# EasyEDA Pro project ProPrj_Syndra Version 2_2026-02-07.epro, schematic Schematic1
Board Name: Control Board; Create Date: 2025-08-30; Page Name: Systems; Project Name: Syndra Version 2; Schematic Name: Schematic1; Update Date: 2026-01-21; Company: EasyEDA.com; Page Size: A4; Version: V1.0
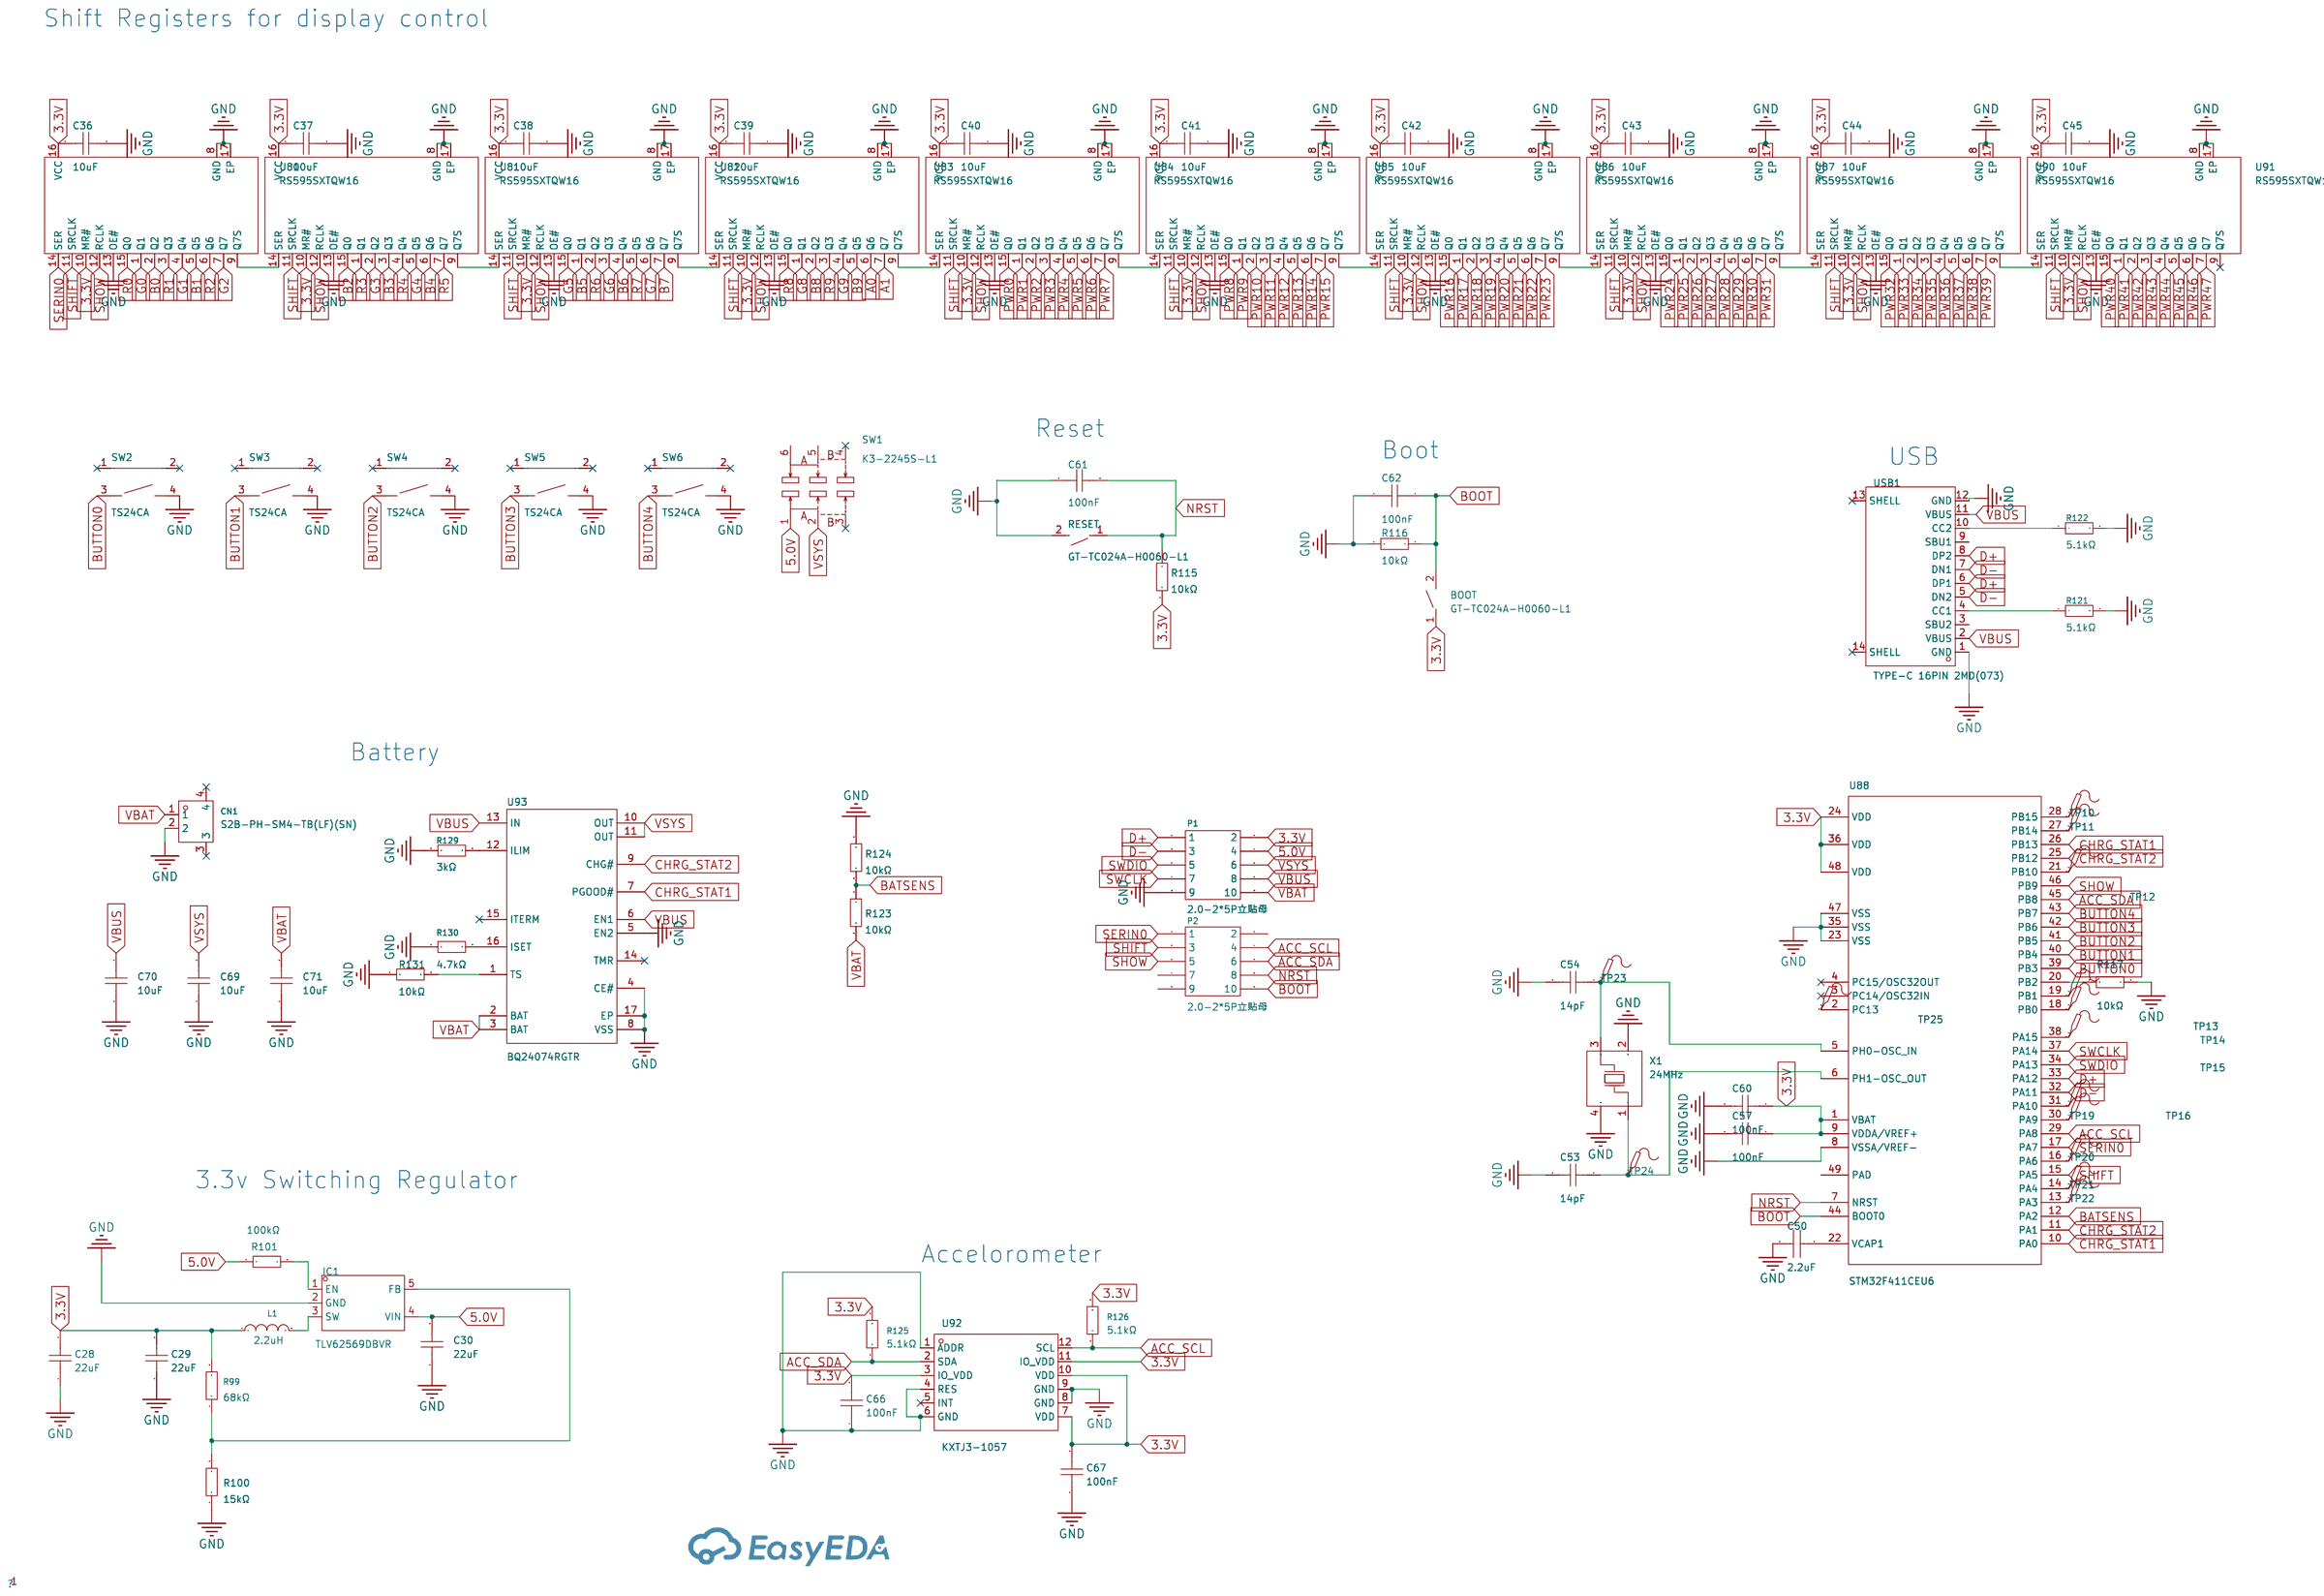
[diagram p1: schematic sheet]

## Parts
BOOT  GT-TC024A-H0060-L1  [SW-SMD_L3.0-W2.0-LS3.5]
C28  22uF  [C0603]
C29  22uF  [C0603]
C30  22uF  [C0603]
C36  10uF  [C0402]
C37  10uF  [C0402]
C38  10uF  [C0402]
C39  10uF  [C0402]
C40  10uF  [C0402]
C41  10uF  [C0402]
C42  10uF  [C0402]
C43  10uF  [C0402]
C44  10uF  [C0402]
C45  10uF  [C0402]
C50  2.2uF  [C0402]
C53  14pF  [C0402]
C54  14pF  [C0402]
C57  100nF  [C0402]
C60  100nF  [C0402]
C61  100nF  [C0402]
C62  100nF  [C0402]
C66  100nF  [C0402]
C67  100nF  [C0402]
C69  10uF  [C0402]
C70  10uF  [C0402]
C71  10uF  [C0402]
CN1  S2B-PH-SM4-TB(LF)(SN)  [CONN-SMD_P2.00_S2B-PH-SM4-TB-LF-SN]
IC1  TLV62569DBVR  [SOT-23-5_L3.0-W1.7-P0.95-LS2.8-BR]
L1  2.2uH  [IND-SMD_L2.5-W2.0]
P1  2.0-2*5P立贴母  [HDR-SMD_10P-P2.00-V-F-R2-C5-S2.00-LS6.0]
P2  2.0-2*5P立贴母  [HDR-SMD_10P-P2.00-V-F-R2-C5-S2.00-LS6.0]
R99  68kΩ  [R0402]
R100  15kΩ  [R0402]
R101  100kΩ  [R0402]
R115  10kΩ  [R0402]
R116  10kΩ  [R0402]
R117  10kΩ  [R0402]
R121  5.1kΩ  [R0402]
R122  5.1kΩ  [R0402]
R123  10kΩ  [R0402]
R124  10kΩ  [R0402]
R125  5.1kΩ  [R0402]
R126  5.1kΩ  [R0402]
R129  3kΩ  [R0603]
R130  4.7kΩ  [R0402]
R131  10kΩ  [R0402]
RESET  GT-TC024A-H0060-L1  [SW-SMD_L3.0-W2.0-LS3.5]
SW1  K3-2245S-L1  [SW-TH_K3-2245S-L1]
SW2  TS24CA  [SW-SMD_TS24CA]
SW3  TS24CA  [SW-SMD_TS24CA]
SW4  TS24CA  [SW-SMD_TS24CA]
SW5  TS24CA  [SW-SMD_TS24CA]
SW6  TS24CA  [SW-SMD_TS24CA]
TP10  -  [Test-Point-0.5mm]
TP11  -  [Test-Point-0.5mm]
TP12  -  [Test-Point-0.5mm]
TP13  -  [Test-Point-0.5mm]
TP14  -  [Test-Point-0.5mm]
TP15  -  [Test-Point-0.5mm]
TP16  -  [Test-Point-0.5mm]
TP19  -  [Test-Point-0.5mm]
TP20  -  [Test-Point-0.5mm]
TP21  -  [Test-Point-0.5mm]
TP22  -  [Test-Point-0.5mm]
TP23  -  [Test-Point-0.5mm]
TP24  -  [Test-Point-0.5mm]
TP25  -  [Test-Point-0.5mm]
U80  RS595SXTQW16  [DHVQFN-16_L3.5-W2.5-P0.50-BL-EP]
U81  RS595SXTQW16  [DHVQFN-16_L3.5-W2.5-P0.50-BL-EP]
U82  RS595SXTQW16  [DHVQFN-16_L3.5-W2.5-P0.50-BL-EP]
U83  RS595SXTQW16  [DHVQFN-16_L3.5-W2.5-P0.50-BL-EP]
U84  RS595SXTQW16  [DHVQFN-16_L3.5-W2.5-P0.50-BL-EP]
U85  RS595SXTQW16  [DHVQFN-16_L3.5-W2.5-P0.50-BL-EP]
U86  RS595SXTQW16  [DHVQFN-16_L3.5-W2.5-P0.50-BL-EP]
U87  RS595SXTQW16  [DHVQFN-16_L3.5-W2.5-P0.50-BL-EP]
U88  STM32F411CEU6  [UFQFPN-48_L7.0-W7.0-P0.50-BL-EP]
U90  RS595SXTQW16  [DHVQFN-16_L3.5-W2.5-P0.50-BL-EP]
U91  RS595SXTQW16  [DHVQFN-16_L3.5-W2.5-P0.50-BL-EP]
U92  KXTJ3-1057  [LGA-12_L2.0-W2.0-P0.50-BL]
U93  BQ24074RGTR  [QFN-16_L3.0-W3.0-P0.50-TL-EP1.7]
USB1  TYPE-C 16PIN 2MD(073)  [USB-C-SMD_TYPE-C-6PIN-2MD-073]
X1  24MHz  [CRYSTAL-SMD_4P-L3.2-W2.5-BL]

## Library data of the parts
BOOT RESET = GT-TC024A-H0060-L1: Circuit:SPST Actuator Style:Round Button Operating Force:160gf Mounting Type:Standing paste Length:3mm Width:2mm Switch Height:0.6mm Strike Gundam:Without bracket Contact Current:50mA Voltage Rating:12V Actuator/Cap Color:Black With Lamp:None Termination; LCSC Part Name: 3*2*0.6mm 立贴 轻触开关; Supplier Part: C778126; Manufacturer: G-Switch(品赞); Supplier Footprint: SMD; JLCPCB Part Class: Extended Part; Datasheet: https://atta.szlcsc.com/upload/public/pdf/source/20250310/003EC24A7B6F36331F0419CCF371D4CC.pdf; Supplier: LCSC; Circuit: SPST; Actuator Style: Round Button; Operating Force: 160gf; Mounting Type: Standing paste; Length: 3mm; Width: 2mm; Switch Height: 0.6mm; Strike Gundam: Without bracket; Contact Current: 50mA; Voltage Rating: 12V; Actuator/Cap Color: Black; With Lamp: None; Termination Style: SMDSplicing; Life: 100000 Times; Operating Temperature: -30℃~+85℃
C28-C30 = CL10A226MQ8NRNC: Capacitance:22uF Tolerance:±20% Tolerance:±20% Voltage Rating:6.3V Temperature Coefficient:X5R; LCSC Part Name: 22uF ±20% 6.3V; Supplier Part: C59461; Manufacturer: SAMSUNG(三星); Supplier Footprint: 0603; JLCPCB Part Class: Basic Part; Datasheet: https://item.szlcsc.com/datasheet/CL10A226MQ8NRNC/60514.html; Supplier: LCSC; Tolerance: ±20%; Voltage Rating: 6.3V; Temperature Coefficient: X5R
C36-C45 C69-C71 = CL05A106MQ5NUNC: Capacitance:10uF Tolerance:±20% Tolerance:±20% Voltage Rating:6.3V Temperature Coefficient:X5R; LCSC Part Name: 10uF ±20% 6.3V; Supplier Part: C15525; Manufacturer: SAMSUNG(三星); Supplier Footprint: 0402; JLCPCB Part Class: Basic Part; Datasheet: https://item.szlcsc.com/datasheet/CL05A106MQ5NUNC/16204.html; Supplier: LCSC; Tolerance: ±20%; Temperature Coefficient: X5R; Voltage Rating: 6.3V
C50 = CL05A225MQ5NSNC: Capacitance:2.2uF Tolerance:±20% Tolerance:±20% Voltage Rating:6.3V Temperature Coefficient:X5R; LCSC Part Name: 2.2uF ±20% 6.3V; Supplier Part: C12530; Manufacturer: SAMSUNG(三星); Supplier Footprint: 0402; JLCPCB Part Class: Basic Part; Datasheet: https://item.szlcsc.com/datasheet/CL05A225MQ5NSNC/13164.html; Supplier: LCSC; Tolerance: ±20%; Voltage Rating: 6.3V; Temperature Coefficient: X5R
C53 C54 = 0402CG140J500NT: Capacitance:14pF Tolerance:±5% Tolerance:±5% Voltage Rating:50V Temperature Coefficient:C0G; LCSC Part Name: 14pF ±5% 50V; Supplier Part: C3037644; Manufacturer: FH(风华); Supplier Footprint: 0402; JLCPCB Part Class: Extended Part; Datasheet: https://item.szlcsc.com/datasheet/0402CG140J500NT/3589534.html; Supplier: LCSC; Tolerance: ±5%; Voltage Rating: 50V; Temperature Coefficient: C0G
C57 C60-C62 C66 C67 = CL05B104KB54PNC: Capacitance: Tolerance:±10% Tolerance:±10% Voltage Rated: Temperature Coefficient:; LCSC Part Name: 100nF ±10% 50V; Supplier Part: C307331; Manufacturer: SAMSUNG(三星); Supplier Footprint: 0402; JLCPCB Part Class: Basic Part; Datasheet: https://atta.szlcsc.com/upload/public/pdf/source/20181009/C307331_222F7C870FD3EA5F46F538B483443886.pdf; Supplier: LCSC; Tolerance: ±10%
CN1 = S2B-PH-SM4-TB(LF)(SN): Pins Structure:1x2P Pitch:2mm Mounting Style:Horizontal attachment Reference Series:PH Number of Pins:2P Number of Rows:1 Number of PINs Per Row:2 Row Spacing:- Current Rating (Max):2A Contact Material:Copper alloy Contact Plating:Tin Operating Temperatur; LCSC Part Name: 1x2P 间距:2mm 卧贴 系列:PH; Supplier Part: C295747; Manufacturer: JST; Supplier Footprint: SMD,P=2mm,卧贴; JLCPCB Part Class: Extended Part; Datasheet: https://atta.szlcsc.com/upload/public/pdf/source/20210203/C295747_344B2E64535E381E727D98C302AB61C7.pdf; Supplier: LCSC; Pins Structure: 1x2P; Pitch: 2mm; Mounting Style: Horizontal attachment; Reference Series: PH; Number of Pins: 2P; Number of Rows: 1; Number of PINs Per Row: 2; Current Rating (Max): 2A; Contact Material: Copper alloy; Contact Plating: Tin; Operating Temperature Range: -25℃~+85℃; Rated Voltage (Max): 100V; Plastic Material: PA; Flame Retardant Rating: UL94V-0; Supplementary Features: Auxiliary soldering legs; Colour: Beige; Z-Height of the Board: 5.5mm; X-Length of Bottom Edge on Board (Spacing Line): 7.9mm; Y-Width of Bottom Edge on Board: 8.6mm; Gender: 公型插针
IC1 = TLV62569DBVR: Function:Step-down type Output Type:Adjustable Voltage - Supply:2.5V~5.5V Voltage - Supply:2.5V~5.5V Output Voltage:600mV~5.5V Output Voltage:600mV~5.5V Output Current:2A Frequency - Switching:1.5MHz Frequency - Switching:1.5MHz Operating Temperature:-40℃; LCSC Part Name: 高效率同步降压转换器; Supplier Part: C141836; Manufacturer: TI(德州仪器); Supplier Footprint: SOT-23-5; JLCPCB Part Class: Extended Part; Datasheet: https://www.ti.com/cn/lit/gpn/tlv62569; Supplier: LCSC; Function: Step-down type; Output Type: Adjustable; Voltage - Supply: 2.5V~5.5V; Output Voltage: 600mV~5.5V; Output Current: 2A; Frequency - Switching: 1.5MHz; Operating Temperature: -40℃~+125℃@(TJ); Synchronous Rectifier: Yes; Number of Outputs: 1; Topology: Step-down; Switch tube (built-in/external): Built-in
L1 = 252012CDMCDDS-2R2MC: Inductance: Tolerance:±20% Tolerance:±20% Rated Current:- Saturation Current (Isat):3.3A DC Resistance (DCR): Type:- Ratings:-; LCSC Part Name: 2.2uH ±20% 3.3A; Supplier Part: C351245; Manufacturer: Sumida(胜美达); Supplier Footprint: 1008; JLCPCB Part Class: Extended Part; Datasheet: https://atta.szlcsc.com/upload/public/pdf/source/20200117/C402827_B526122D20298252B24DE2C667CE1009.pdf; Supplier: LCSC; Tolerance: ±20%; Saturation Current (Isat): 3.3A
P1 P2 = 2.0-2*5P立贴母: Holes Structure:2x5P Pitch:2mm Row Spacing:2mm Mounting Type:- Number of Rows:双排 Number of Holes:10P Insulation Height:- Contact Material:Brass Contact Plating:Gold; LCSC Part Name: 间距:2mm 2x5P; Supplier Part: C64617; Manufacturer: BOOMELE(博穆精密); Supplier Footprint: SMD,P=2mm; JLCPCB Part Class: Extended Part; Datasheet: https://atta.szlcsc.com/upload/public/pdf/source/20180628/C64617_FEFE692192856C9C522C03721D863C69.pdf; Supplier: LCSC; Holes Structure: 2x5P; Pitch: 2mm; Row Spacing: 2mm; Number of Rows: 双排; Number of Holes: 10P; Contact Material: Brass; Contact Plating: Gold
R99 = RC0402FR-0768KL: Type:Thick Film Resistor Resistance:68kΩ Tolerance:±1% Tolerance:±1% Power(Watts):62.5mW Voltage-Supply(Max):50V Temperature Coefficient:±100ppm/℃ Temperature Coefficient:±100ppm/℃ Operating Temperature:-55℃~+155℃ Operating Temperature:-55℃~+155℃; LCSC Part Name: 厚膜电阻 68kΩ ±1% 62.5mW; Supplier Part: C137947; Manufacturer: YAGEO(国巨); Supplier Footprint: 0402; JLCPCB Part Class: Extended Part; Datasheet: https://atta.szlcsc.com/upload/public/pdf/source/20250610/89E4D743C004A82A45145C7A2CC3A578.pdf; Supplier: LCSC; Type: Thick Film Resistor; Tolerance: ±1%; Power(Watts): 62.5mW; Voltage-Supply(Max): 50V; Temperature Coefficient: ±100ppm/℃; Operating Temperature: -55℃~+155℃
R100 = 0402WGF1502TCE: Type:Thick Film Resistors Resistance:15kΩ Tolerance:±1% Tolerance:±1% Power(Watts): Overload Voltage (Max): Temperature Coefficient:±100ppm/℃ Temperature Coefficient:±100ppm/℃ Operating Temperature Range:-55℃~+155℃ Operating Temperature Range:-55℃~+155℃; LCSC Part Name: 15kΩ ±1% 62.5mW 厚膜电阻; Supplier Part: C25756; Manufacturer: UNI-ROYAL(厚声); Supplier Footprint: 0402; JLCPCB Part Class: Basic Part; Datasheet: https://atta.szlcsc.com/upload/public/pdf/source/20200306/C422600_1E6D84923E4A46A82E41ADD87F860B5C.pdf; Supplier: LCSC; Type: Thick Film Resistors; Tolerance: ±1%; Temperature Coefficient: ±100ppm/℃; Operating Temperature Range: -55℃~+155℃
R101 = 0402WGF1003TCE: Type:Thick Film Resistor Resistance:100kΩ Tolerance:±1% Tolerance:±1% Power(Watts):62.5mW Voltage-Supply(Max):50V Temperature Coefficient:±100ppm/℃ Temperature Coefficient:±100ppm/℃ Operating Temperature:-55℃~+155℃ Operating Temperature:-55℃~+155℃; LCSC Part Name: 100kΩ ±1% 62.5mW 厚膜电阻; Supplier Part: C25741; Manufacturer: UNI-ROYAL(厚声); Supplier Footprint: 0402; JLCPCB Part Class: Basic Part; Datasheet: https://item.szlcsc.com/datasheet/0402WGF1003TCE/26484.html; Supplier: LCSC; Type: Thick Film Resistor; Tolerance: ±1%; Power(Watts): 62.5mW; Voltage-Supply(Max): 50V; Temperature Coefficient: ±100ppm/℃; Operating Temperature: -55℃~+155℃
R115-R117 R123 R124 R131 = 0402WGF1002TCE: Type:Thick Film Resistor Resistance:10kΩ Tolerance:±1% Tolerance:±1% Power(Watts):62.5mW Voltage-Supply(Max):50V Temperature Coefficient:±100ppm/℃ Temperature Coefficient:±100ppm/℃ Operating Temperature:-55℃~+155℃ Operating Temperature:-55℃~+155℃; LCSC Part Name: 10kΩ ±1% 62.5mW 厚膜电阻; Supplier Part: C25744; Manufacturer: UNI-ROYAL(厚声); Supplier Footprint: 0402; JLCPCB Part Class: Basic Part; Datasheet: https://item.szlcsc.com/datasheet/0402WGF1002TCE/26487.html; Supplier: LCSC; Type: Thick Film Resistor; Tolerance: ±1%; Power(Watts): 62.5mW; Voltage-Supply(Max): 50V; Temperature Coefficient: ±100ppm/℃; Operating Temperature: -55℃~+155℃
R121 R122 R125 R126 = 0402WGF5101TCE: Type:Thick Film Resistor Resistance:5.1kΩ Tolerance:±1% Tolerance:±1% Power(Watts):62.5mW Voltage-Supply(Max):50V Temperature Coefficient:±100ppm/℃ Temperature Coefficient:±100ppm/℃ Operating Temperature:-55℃~+155℃ Operating Temperature:-55℃~+155℃; LCSC Part Name: 5.1kΩ ±1% 62.5mW 厚膜电阻; Supplier Part: C25905; Manufacturer: UNI-ROYAL(厚声); Supplier Footprint: 0402; JLCPCB Part Class: Basic Part; Datasheet: https://item.szlcsc.com/datasheet/0402WGF5101TCE/26648.html; Supplier: LCSC; Type: Thick Film Resistor; Tolerance: ±1%; Power(Watts): 62.5mW; Voltage-Supply(Max): 50V; Temperature Coefficient: ±100ppm/℃; Operating Temperature: -55℃~+155℃
R129 = 0603WAF3001T5E: Type:Thick Film Resistor Resistance:3kΩ Tolerance:±1% Tolerance:±1% Power(Watts):100mW Voltage-Supply(Max):75V Temperature Coefficient:±100ppm/℃ Temperature Coefficient:±100ppm/℃ Operating Temperature:-55℃~+155℃ Operating Temperature:-55℃~+155℃; LCSC Part Name: 3kΩ ±1% 100mW 厚膜电阻; Supplier Part: C4211; Manufacturer: UNI-ROYAL(厚声); Supplier Footprint: 0603; JLCPCB Part Class: Basic Part; Datasheet: https://item.szlcsc.com/datasheet/0603WAF3001T5E/4618.html; Supplier: LCSC; Type: Thick Film Resistor; Tolerance: ±1%; Power(Watts): 100mW; Voltage-Supply(Max): 75V; Temperature Coefficient: ±100ppm/℃; Operating Temperature: -55℃~+155℃
R130 = 0402WGF4701TCE: Type:Thick Film Resistor Resistance:4.7kΩ Tolerance:±1% Tolerance:±1% Power(Watts):62.5mW Voltage-Supply(Max):50V Temperature Coefficient:±100ppm/℃ Temperature Coefficient:±100ppm/℃ Operating Temperature:-55℃~+155℃ Operating Temperature:-55℃~+155℃; LCSC Part Name: 4.7kΩ ±1% 62.5mW 厚膜电阻; Supplier Part: C25900; Manufacturer: UNI-ROYAL(厚声); Supplier Footprint: 0402; JLCPCB Part Class: Basic Part; Datasheet: https://item.szlcsc.com/datasheet/0402WGF4701TCE/26643.html; Supplier: LCSC; Type: Thick Film Resistor; Tolerance: ±1%; Power(Watts): 62.5mW; Voltage-Supply(Max): 50V; Temperature Coefficient: ±100ppm/℃; Operating Temperature: -55℃~+155℃
SW1 = K3-2245S-L1: Circuit:DPDT Actuator Style:Rectangular columnar Pin Style:Gull Wing Switch Length:9mm Switch Width:3.5mm Switch Height:3.5mm Mounting Style:卧贴 Actuator Color:Black Current Rating (DC):300mA Voltage Rating (DC):6V Current Rating (AC):- Voltage Rating (AC); LCSC Part Name: 卧贴双档 滑动开关; Supplier Part: C223862; Manufacturer: 韩国韩荣; Supplier Footprint: SMD; JLCPCB Part Class: Extended Part; Datasheet: https://atta.szlcsc.com/upload/public/pdf/source/20210810/44D21D07493BFE976BA3ADF84684D260.pdf; Supplier: LCSC; Circuit: DPDT; Actuator Style: Rectangular columnar; Pin Style: Gull Wing; Switch Length: 9mm; Switch Width: 3.5mm; Switch Height: 3.5mm; Mounting Style: 卧贴; Actuator Color: Black; Current Rating (DC): 300mA; Voltage Rating (DC): 6V; Mechanical Life: 1万次; Operating Temperature: -25℃~+80℃
SW2-SW6 = TS24CA: Circuit:SPST Actuator Style:Rectangular Button Mounting Type:Surface Mount, Right Angle Length:4.55mm Width:1.8mm Switch Height:3.5mm Contact Current:50mA Voltage Rating:12V With Lamp:- Life:-; LCSC Part Name: 4.55*1.8*3.5mm 卧贴 轻触开关; Supplier Part: C393942; Manufacturer: SHOU HAN(首韩); Supplier Footprint: SMD; JLCPCB Part Class: Extended Part; Datasheet: https://atta.szlcsc.com/upload/public/pdf/source/20240424/43D93777DD1504A9F6E2A772ABCDC7B4.pdf; Supplier: LCSC; Circuit: SPST; Actuator Style: Rectangular Button; Mounting Type: Surface Mount, Right Angle; Length: 4.55mm; Width: 1.8mm; Switch Height: 3.5mm; Contact Current: 50mA; Voltage Rating: 12V
TP10-TP16 TP19-TP25 = Test-Point: Test Point 测试点
U80-U87 U90 U91 = RS595SXTQW16: LCSC Part Name: 逻辑RS595S; Supplier Part: C19268125; Manufacturer: RUNIC(润石); Supplier Footprint: QFN-16L(2.5x3.5); JLCPCB Part Class: Extended Part; Datasheet: https://atta.szlcsc.com/upload/public/pdf/source/20231127/2269817A6DBF40228CACAC1A57EEE2C9.pdf; Supplier: LCSC
U88 = STM32F411CEU6: CPU Core:ARM-M4 CPU Maximum Speed:100MHz Program Storage Size:512KB Program Memory Type:FLASH Number of I/O:36 ADC (Bit):12bit Voltage - Supply:1.7V~3.6V Voltage - Supply:1.7V~3.6V Applications:-; LCSC Part Name: 带DSP和FPU的高性能基本型系列ARM Cortex-M4 MCU，具有512 KB Flash、100 MHz CPU和ART加速器; Supplier Part: C60420; Manufacturer: ST(意法半导体); Supplier Footprint: UFQFPN-48(7x7); JLCPCB Part Class: Extended Part; Datasheet: https://item.szlcsc.com/datasheet/STM32F411CEU6/61472.html; Supplier: LCSC; CPU Core: ARM-M4; CPU Maximum Speed: 100MHz; Program Storage Size: 512KB; Program Memory Type: FLASH; Number of I/O: 36; ADC (Bit): 12bit; Voltage - Supply: 1.7V~3.6V
U92 = KXTJ3-1057: Supplier Part: C442603; Manufacturer: ROHM(罗姆); Supplier Footprint: LGA-12(2x2); JLCPCB Part Class: Extended Part; Datasheet: https://atta.szlcsc.com/upload/public/pdf/source/20191031/C442603_12AC3C8489586CE5186C5DB6A78C43C5.pdf; Supplier: LCSC
U93 = BQ24074RGTR: The Chip Type:- Voltage - Supply:4.35V~26V Voltage - Supply:4.35V~26V Charge Current - Max:- Charging Saturation Voltage:4.2V Type of Battery:Lithium-ion/Polymer Number of Cells:1 Number of Cells:1 Operating Temperature:-40℃~+85℃ Operating Temperature:-40; LCSC Part Name: USB友好型1.5A锂离子电池充电器和电源路径管理IC; Supplier Part: C54313; Manufacturer: TI(德州仪器); Supplier Footprint: QFN-16-EP(3x3); JLCPCB Part Class: Extended Part; Datasheet: https://www.ti.com/cn/lit/gpn/bq24074; Supplier: LCSC; Voltage - Supply: 4.35V~26V; Charging Saturation Voltage: 4.2V; Type of Battery: Lithium-ion/Polymer; Number of Cells: 1; Operating Temperature: -40℃~+85℃
USB1 = TYPE-C 16PIN 2MD(073): Connector Type:Type-C Protocol Standard:USB 3.1 Gender:Female Mounting Type:Surface Mount, Right Angle Number of Contacts:16P Number of Ports:1 Current Rating-Power:3A Voltage Rating:5V Connect-Disconnect Life:5,000 Cycles Supplementary Features:- Center; LCSC Part Name: Type-C 母 卧贴; Supplier Part: C2765186; Manufacturer: SHOU HAN(首韩); Supplier Footprint: SMD; JLCPCB Part Class: Extended Part; Datasheet: https://atta.szlcsc.com/upload/public/pdf/source/20250506/FFB74EDFDFA0AC372CE4A8E4F739CCEF.pdf; Supplier: LCSC; Connector Type: Type-C; Protocol Standard: USB 3.1; Gender: Female; Mounting Type: Surface Mount, Right Angle; Number of Contacts: 16P; Number of Ports: 1; Current Rating-Power: 3A; Voltage Rating: 5V; Connect-Disconnect Life: 5,000 Cycles; Detection color: Black; Operating Temperature: -25℃~+85℃
X1 = X322524MOB4SI: Type:Surface Mount Crystal Frequency:24MHz Normal temperature Frequency Tolerance:±10ppm Normal temperature Frequency Tolerance:±10ppm Load Capacitance:12pF Frequency Stability:±20ppm Frequency Stability:±20ppm Operating Temperature:-40℃~+85℃ Operating Te; LCSC Part Name: YSX321SL 24MHZ 4P 3225 12PF ±10PPM -40~85℃ (±20PPM); Supplier Part: C70590; Manufacturer: YXC(扬兴晶振); Supplier Footprint: SMD3225-4P; JLCPCB Part Class: Extended Part; Datasheet: https://item.szlcsc.com/datasheet/X322524MOB4SI/71688.html; Supplier: LCSC; Type: Surface Mount Crystal; Normal temperature Frequency Tolerance: ±10ppm; Load Capacitance: 12pF; Frequency Stability: ±20ppm; Operating Temperature: -40℃~+85℃

## Nets
3.3V: BOOT.1 C28.2 C29.2 C36.2 C37.2 C38.2 C39.2 C40.2 C41.2 C42.2 C43.2 C44.2 C45.2 C57.1 C60.1 C66.2 C67.2 L1.1 P1.2 R99.2 R115.2 R125.2 R126.2 U80.10(MR#) U80.16(VCC) U81.10(MR#) U81.16(VCC) U82.10(MR#) U82.16(VCC) U83.10(MR#) U83.16(VCC) U84.10(MR#) U84.16(VCC) U85.10(MR#) U85.16(VCC) U86.10(MR#) U86.16(VCC) U87.10(MR#) U87.16(VCC) U88.1(VBAT) U88.9(VDDA/VREF+) U88.24(VDD) U88.36(VDD) U88.48(VDD) U90.10(MR#) U90.16(VCC) U91.10(MR#) U91.16(VCC) U92.3(IO_VDD) U92.7(VDD) U92.10(VDD) U92.11(IO_VDD)
5.0V: C30.2 IC1.4(VIN) P1.4 R101.1 SW1.1
GND: C28.1 C29.1 C30.1 C36.1 C37.1 C38.1 C39.1 C40.1 C41.1 C42.1 C43.1 C44.1 C45.1 C50.1 C53.2 C54.2 C57.2 C60.2 C61.1 C62.2 C66.1 C67.1 C69.1 C70.2 C71.1 CN1.2 IC1.2(GND) P1.9 R100.1 R116.2 R117.1 R121.2 R122.2 R124.1 R129.1 R130.1 R131.2 RESET.2 SW2.4 SW3.4 SW4.4 SW5.4 SW6.4 U80.8(GND) U80.13(OE#) U80.17(EP) U81.8(GND) U81.13(OE#) U81.17(EP) U82.8(GND) U82.13(OE#) U82.17(EP) U83.8(GND) U83.13(OE#) U83.17(EP) U84.8(GND) U84.13(OE#) U84.17(EP) U85.8(GND) U85.13(OE#) U85.17(EP) U86.8(GND) U86.13(OE#) U86.17(EP) U87.8(GND) U87.13(OE#) U87.17(EP) U88.8(VSSA/VREF-) U88.23(VSS) U88.35(VSS) U88.47(VSS) U90.8(GND) U90.13(OE#) U90.17(EP) U91.8(GND) U91.13(OE#) U91.17(EP) U92.1(ADDR) U92.4(RES) U92.6(GND) U92.8(GND) U92.9(GND) U93.4(CE#) U93.5(EN2) U93.8(VSS) U93.17(EP) USB1.1(GND) USB1.12(GND) X1.2(GND) X1.4(GND)
VBAT: C71.2 CN1.1 P1.10 R123.2 U93.2(BAT) U93.3(BAT)
VBUS: C70.1 P1.8 U93.6(EN1) U93.13(IN) USB1.2(VBUS) USB1.11(VBUS)
A0: U83.6(Q6)
A1: U83.7(Q7)
ACC_SCL: P2.4 R126.1 U88.29(PA8) U92.12(SCL)
ACC_SDA: P2.6 R125.1 U88.45(PB8) U92.2(SDA)
B0: U80.2(Q2)
B1: U80.5(Q5)
B2: U81.15(Q0)
B3: U81.3(Q3)
B4: U81.6(Q6)
B5: U82.1(Q1)
B6: U82.4(Q4)
B7: U82.7(Q7)
B8: U83.2(Q2)
B9: U83.5(Q5)
BATSENS: R123.1 R124.2 U88.12(PA2)
BOOT: BOOT.2 C62.1 P2.10 R116.1 U88.44(BOOT0)
BUTTON0: SW2.3 U88.39(PB3)
BUTTON1: SW3.3 U88.40(PB4)
BUTTON2: SW4.3 U88.41(PB5)
BUTTON3: SW5.3 U88.42(PB6)
BUTTON4: SW6.3 U88.43(PB7)
CHRG_STAT1: U88.10(PA0) U88.26(PB13) U93.7(PGOOD#)
CHRG_STAT2: U88.11(PA1) U88.25(PB12) U93.9(CHG#)
D+: P1.1 U88.33(PA12) USB1.6(DP1) USB1.8(DP2)
D-: P1.3 U88.32(PA11) USB1.5(DN2) USB1.7(DN1)
G0: U80.1(Q1)
G1: U80.4(Q4)
G2: U80.7(Q7)
G3: U81.2(Q2)
G4: U81.5(Q5)
G5: U82.15(Q0)
G6: U82.3(Q3)
G7: U82.6(Q6)
G8: U83.1(Q1)
G9: U83.4(Q4)
NRST: C61.2 P2.8 R115.1 RESET.1 U88.7(NRST)
PWR0: U84.15(Q0)
PWR1: U84.1(Q1)
PWR2: U84.2(Q2)
PWR3: U84.3(Q3)
PWR4: U84.4(Q4)
PWR5: U84.5(Q5)
PWR6: U84.6(Q6)
PWR7: U84.7(Q7)
PWR8: U85.15(Q0)
PWR9: U85.1(Q1)
PWR10: U85.2(Q2)
PWR11: U85.3(Q3)
PWR12: U85.4(Q4)
PWR13: U85.5(Q5)
PWR14: U85.6(Q6)
PWR15: U85.7(Q7)
PWR16: U86.15(Q0)
PWR17: U86.1(Q1)
PWR18: U86.2(Q2)
PWR19: U86.3(Q3)
PWR20: U86.4(Q4)
PWR21: U86.5(Q5)
PWR22: U86.6(Q6)
PWR23: U86.7(Q7)
PWR24: U87.15(Q0)
PWR25: U87.1(Q1)
PWR26: U87.2(Q2)
PWR27: U87.3(Q3)
PWR28: U87.4(Q4)
PWR29: U87.5(Q5)
PWR30: U87.6(Q6)
PWR31: U87.7(Q7)
PWR32: U90.15(Q0)
PWR33: U90.1(Q1)
PWR34: U90.2(Q2)
PWR35: U90.3(Q3)
PWR36: U90.4(Q4)
PWR37: U90.5(Q5)
PWR38: U90.6(Q6)
PWR39: U90.7(Q7)
PWR40: U91.15(Q0)
PWR41: U91.1(Q1)
PWR42: U91.2(Q2)
PWR43: U91.3(Q3)
PWR44: U91.4(Q4)
PWR45: U91.5(Q5)
PWR46: U91.6(Q6)
PWR47: U91.7(Q7)
R0: U80.15(Q0)
R1: U80.3(Q3)
R2: U80.6(Q6)
R3: U81.1(Q1)
R4: U81.4(Q4)
R5: U81.7(Q7)
R6: U82.2(Q2)
R7: U82.5(Q5)
R8: U83.15(Q0)
R9: U83.3(Q3)
SERIN0: P2.1 U80.14(SER) U88.17(PA7)
SHIFT: P2.3 U80.11(SRCLK) U81.11(SRCLK) U82.11(SRCLK) U83.11(SRCLK) U84.11(SRCLK) U85.11(SRCLK) U86.11(SRCLK) U87.11(SRCLK) U88.15(PA5) U90.11(SRCLK) U91.11(SRCLK)
SHOW: P2.5 U80.12(RCLK) U81.12(RCLK) U82.12(RCLK) U83.12(RCLK) U84.12(RCLK) U85.12(RCLK) U86.12(RCLK) U87.12(RCLK) U88.46(PB9) U90.12(RCLK) U91.12(RCLK)
SWCLK: P1.7 U88.37(PA14)
SWDIO: P1.5 U88.34(PA13)
VSYS: C69.2 P1.6 SW1.2 U93.10(OUT) U93.11(OUT)
$3N17348: C50.2 U88.22(VCAP1)
$3N18065: C54.1 TP23.1 U88.5(PH0-OSC_IN) X1.3(OSC2)
$3N18105: C53.1 TP24.1 U88.6(PH1-OSC_OUT) X1.1(OSC1)
$3N22682: U80.9(Q7S) U81.14(SER)
$3N22703: U81.9(Q7S) U82.14(SER)
$3N22707: U82.9(Q7S) U83.14(SER)
$3N22712: U83.9(Q7S) U84.14(SER)
$3N22720: U84.9(Q7S) U85.14(SER)
$3N22724: U85.9(Q7S) U86.14(SER)
$3N22729: U86.9(Q7S) U87.14(SER)
$3N22734: U87.9(Q7S) U90.14(SER)
$3N22739: U90.9(Q7S) U91.14(SER)
$3N24528: R117.2 U88.20(PB2)
$3N26696: R122.1 USB1.10(CC2)
$3N26697: R121.1 USB1.4(CC1)
$3N26698: IC1.1(EN) R101.2
$3N26700: IC1.3(SW) L1.2
$3N26702: IC1.5(FB) R99.1 R100.2
$3N28341: TP10.1 U88.28(PB15)
$3N28362: TP11.1 U88.27(PB14)
$3N28383: TP12.1 U88.21(PB10)
$3N28404: TP13.1 U88.19(PB1)
$3N28425: TP14.1 U88.18(PB0)
$3N28446: TP15.1 U88.38(PA15)
$3N28533: TP19.1 U88.30(PA9)
$3N28554: TP20.1 U88.16(PA6)
$3N28575: TP21.1 U88.14(PA4)
$3N28596: TP22.1 U88.13(PA3)
$3N35955: TP16.1 U88.31(PA10)
$3N35976: TP25.1 U88.2(PC13)
$3N39890: R131.1 U93.1(TS)
$3N40035: R130.2 U93.16(ISET)
$3N40040: R129.2 U93.12(ILIM)

Not connected (* = marked no-connect by the designer): CN1 3* 4*; P2 2 7 9; SW1 3* 4* 5 6; SW2 1* 2*; SW3 1* 2*; SW4 1* 2*; SW5 1* 2*; SW6 1* 2*; U88 3(PC14/OSC32IN)* 4(PC15/OSC32OUT)* 49(PAD); U91 9(Q7S)*; U92 5(INT)*; U93 14(TMR)* 15(ITERM)*; USB1 3(SBU2) 9(SBU1) 13(SHELL)* 14(SHELL)*

## Notes on the sheet
- Shift Registers for display control
- Reset
- Boot
- USB
- Battery
- 3.3v Switching Regulator
- Accelorometer
